# EAGLE schematic KN-CON (EAGLE 6.2)
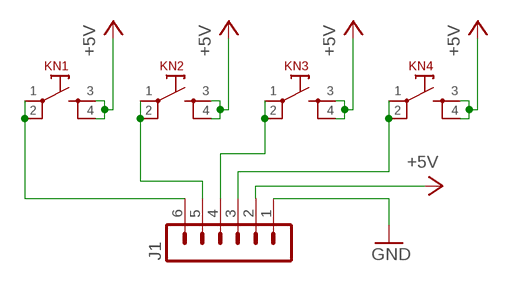
[diagram p0: schematic, sheet 1]

## Parts
J1  MA06-1  [MA06-1]
KN1  LZQ-KN  [LZQ-KN]
KN2  LZQ-KN  [LZQ-KN]
KN3  LZQ-KN  [LZQ-KN]
KN4  LZQ-KN  [LZQ-KN]

## Nets
+5V: J1.2 KN1.3 KN1.4 KN2.3 KN2.4 KN3.3 KN3.4 KN4.3 KN4.4
GND: J1.1
N$1: J1.6 KN1.1 KN1.2
N$2: J1.5 KN2.1 KN2.2
N$5: J1.4 KN3.1 KN3.2
N$6: J1.3 KN4.1 KN4.2

## Library data of the parts
J1 = con-lstb:MA06-1: PIN HEADER
KN1-KN4 = Dmitry:LZQ-KN